# EasyEDA Pro project ProPrj_OAE board.epro

# Schematic OAE board 0.4
Board Name: OAE board 0.4; Create Date: 2025-04-07; Page Name: Sheet_1; Project Name: OAE board 0.2; Schematic Name: OAE board 0.4; Update Date: 2025-04-07; Add into BOM: yes; Company: Your Company; Convert to PCB: yes; Date: 2023-09-23; Draw By: intercipere; REV: 1.0; Sheet: 1/1
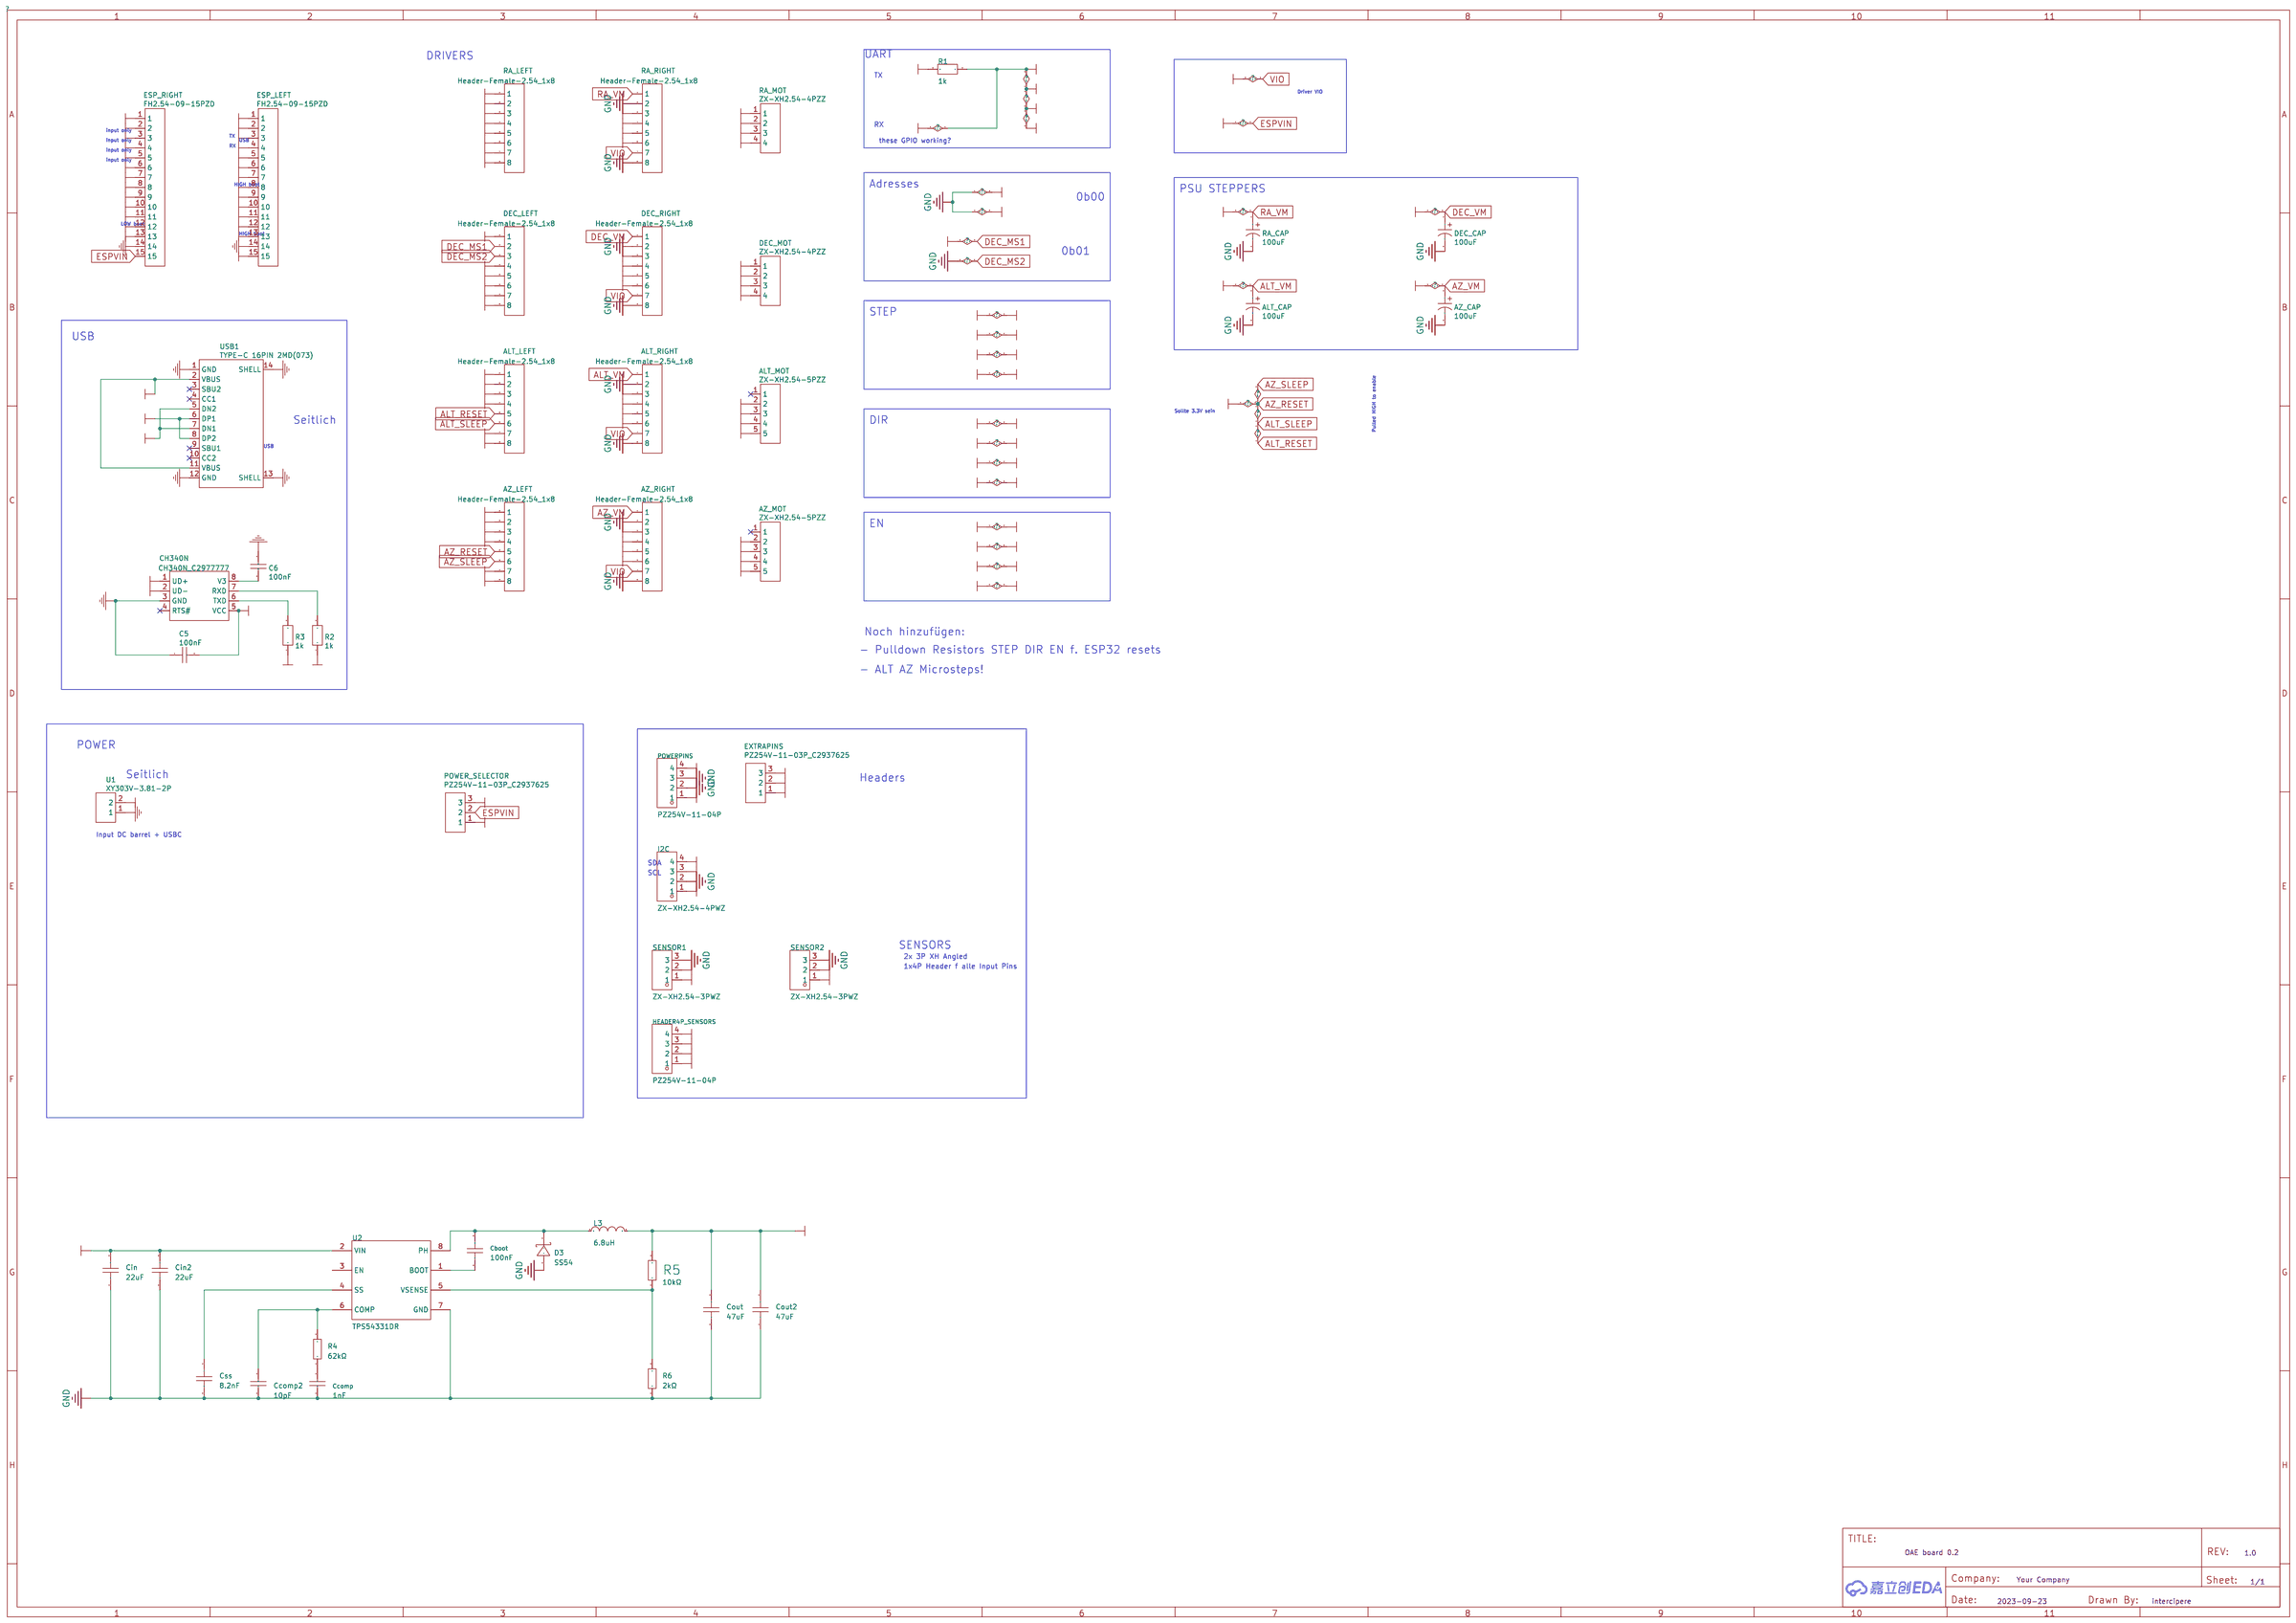
[diagram p0: schematic sheet]

## Parts
ALT_CAP  100uF  [CAP-SMD_BD6.3-L6.6-W6.6-LS7.4-FD]
ALT_LEFT  Header-Female-2.54_1x8  [HDR-TH_8P-P2.54-V-F-1]
ALT_MOT  ZX-XH2.54-5PZZ  [CONN-TH_5P-P2.50_ZX-XH2.54-5PZZ]
ALT_RIGHT  Header-Female-2.54_1x8  [HDR-TH_8P-P2.54-V-F-1]
AZ_CAP  100uF  [CAP-SMD_BD6.3-L6.6-W6.6-LS7.4-FD]
AZ_LEFT  Header-Female-2.54_1x8  [HDR-TH_8P-P2.54-V-F-1]
AZ_MOT  ZX-XH2.54-5PZZ  [CONN-TH_5P-P2.50_ZX-XH2.54-5PZZ]
AZ_RIGHT  Header-Female-2.54_1x8  [HDR-TH_8P-P2.54-V-F-1]
C5  100nF  [C0402]
C6  100nF  [C0402]
Cboot  100nF  [C0603]
Ccomp  1nF  [C0603]
Ccomp2  10pF  [C0603]
CH340N  CH340N_C2977777  [SOP-8_L4.9-W3.9-P1.27-LS6.0-BL]
Cin  22uF  [C0805]
Cin2  22uF  [C0805]
Cout  47uF  [C1206]
Cout2  47uF  [C1206]
Css  8.2nF  [C0603]
D3  SS54  [SMA_L4.4-W2.8-LS5.4-R-RD]
DEC_CAP  100uF  [CAP-SMD_BD6.3-L6.6-W6.6-LS7.4-FD]
DEC_LEFT  Header-Female-2.54_1x8  [HDR-TH_8P-P2.54-V-F-1]
DEC_MOT  ZX-XH2.54-4PZZ  [CONN-TH_4P-P2.50_4PIN]
DEC_RIGHT  Header-Female-2.54_1x8  [HDR-TH_8P-P2.54-V-F-1]
ESP_LEFT  FH2.54-09-15PZD  [HDR-TH_15P-P2.54-V-F-1]
ESP_RIGHT  FH2.54-09-15PZD  [HDR-TH_15P-P2.54-V-F-1]
EXTRAPINS  PZ254V-11-03P_C2937625  [HDR-TH_3P-P2.54-V-M]
HEADER4P_SENSORS  PZ254V-11-04P  [HDR-TH_4P-P2.54-V-M]
I2C  ZX-XH2.54-4PWZ  [CONN-TH_4P-P2.50_ZX-XH2.54-4PWZ]
L3  6.8uH  [IND-SMD_L2.0-W1.3]
POWER_SELECTOR  PZ254V-11-03P_C2937625  [HDR-TH_3P-P2.54-V-M]
POWERPINS  PZ254V-11-04P  [HDR-TH_4P-P2.54-V-M]
R1  1k  [R0603]
R2  1k  [R0603]
R3  1k  [R0603]
R4  62kΩ  [R0805]
R5  10kΩ  [R0603]
R6  2kΩ  [R0603]
RA_CAP  100uF  [CAP-SMD_BD6.3-L6.6-W6.6-LS7.4-FD]
RA_LEFT  Header-Female-2.54_1x8  [HDR-TH_8P-P2.54-V-F-1]
RA_MOT  ZX-XH2.54-4PZZ  [CONN-TH_4P-P2.50_4PIN]
RA_RIGHT  Header-Female-2.54_1x8  [HDR-TH_8P-P2.54-V-F-1]
SENSOR1  ZX-XH2.54-3PWZ  [HDR-TH_3P-P2.50_ZX-XH2.54-3PWZ]
SENSOR2  ZX-XH2.54-3PWZ  [HDR-TH_3P-P2.50_ZX-XH2.54-3PWZ]
U1  XY303V-3.81-2P  [CONN-TH_XY303V-3.81-2P]
U2  TPS54331DR  [SOIC-8_L5.0-W4.0-P1.27-LS6.0-BL]
USB1  TYPE-C 16PIN 2MD(073)  [USB-C-SMD_TYPE-C-6PIN-2MD-073]

## Library data of the parts
ALT_CAP AZ_CAP DEC_CAP RA_CAP = 100uF: Supplier: LCSC; Supplier Part: C2836437; Manufacturer: KNSCHA(科尼盛); Manufacturer Part: RVE100UF35V67RV0072; JLCPCB Part Class: Extended Part; link: https://lcsc.com/eda_search?q=C2836442&%26type=1&ref=editor
ALT_LEFT ALT_RIGHT AZ_LEFT AZ_RIGHT DEC_LEFT DEC_RIGHT RA_LEFT RA_RIGHT = Header-Female-2.54_1x8: Supplier: LCSC; Manufacturer: BOOMELE(博穆精密); Supplier Part: C27438; JLCPCB Part Class: Extended Part
ALT_MOT AZ_MOT = ZX-XH2.54-5PZZ: Supplier: LCSC; Supplier Part: C7429635; Manufacturer: Megastar(兆星); JLCPCB Part Class: Extended Part; link: https://lcsc.com/eda_search?q=C7429635&%26type=1&ref=editor
C5 C6 = 100nF: Supplier: LCSC; Manufacturer Part: CL05B104KO5NNNC; Manufacturer: SAMSUNG(三星); Supplier Part: C1525; JLCPCB Part Class: Basic Part; link: https://lcsc.com/eda_search?q=C1525&%26type=1&ref=editor
Cboot = CC0603KRX7R9BB104: Capacitance: Tolerance:±10% Tolerance:±10% Voltage Rated: Temperature Coefficient:; LCSC Part Name: 100nF ±10% 50V; Supplier Part: C14663; Manufacturer: YAGEO(国巨); Supplier Footprint: 0603; JLCPCB Part Class: Basic Part; Datasheet: https://atta.szlcsc.com/upload/public/pdf/source/20180910/C282072_33301C7F631E79921B82A8DAC6BCC5B3.pdf; Supplier: LCSC; Tolerance: ±10%
Ccomp = CL10B102KB8NNNC: Capacitance: Tolerance:±10% Tolerance:±10% Voltage Rated: Temperature Coefficient:; LCSC Part Name: 1nF ±10% 50V; Supplier Part: C1588; Manufacturer: SAMSUNG(三星); Supplier Footprint: 0603; JLCPCB Part Class: Basic Part; Datasheet: https://atta.szlcsc.com/upload/public/pdf/source/20160218/1457707763339.pdf; Supplier: LCSC; Tolerance: ±10%
Ccomp2 = CL10C100JB8NNNC: Capacitance: Tolerance:±5% Tolerance:±5% Voltage Rated: Temperature Coefficient:; LCSC Part Name: 10pF ±5% 50V; Supplier Part: C1634; Manufacturer: SAMSUNG(三星); Supplier Footprint: 0603; JLCPCB Part Class: Basic Part; Datasheet: https://atta.szlcsc.com/upload/public/pdf/source/20160218/1457707763339.pdf; Supplier: LCSC; Tolerance: ±5%
CH340N = CH340N_C2977777: Supplier: LCSC; Supplier Part: C2977777; Manufacturer: WCH(南京沁恒); JLCPCB Part Class: Extended Part; link: https://lcsc.com/eda_search?q=C2977777&%26type=1&ref=editor
Cin Cin2 = CL21A226MAQNNNE: Capacitance: Tolerance:±20% Tolerance:±20% Voltage Rated: Temperature Coefficient:; LCSC Part Name: 22uF ±20% 25V; Supplier Part: C45783; Manufacturer: SAMSUNG(三星); Supplier Footprint: 0805; JLCPCB Part Class: Basic Part; Datasheet: https://atta.szlcsc.com/upload/public/pdf/source/20160218/1457707763339.pdf; Supplier: LCSC; Tolerance: ±20%
Cout Cout2 = CL31A476MPHNNNE: Capacitance: Tolerance:±20% Tolerance:±20% Voltage Rated: Temperature Coefficient:; LCSC Part Name: 47uF ±20% 10V; Supplier Part: C96123; Manufacturer: SAMSUNG(三星); Supplier Footprint: 1206; JLCPCB Part Class: Basic Part; Datasheet: https://atta.szlcsc.com/upload/public/pdf/source/20160218/1457707763339.pdf; Supplier: LCSC; Tolerance: ±20%
Css = 0603B822K500NT: Capacitance:8.2nF Tolerance:±10% Tolerance:±10% Voltage Rated: Temperature Coefficient:; LCSC Part Name: 8.2nF ±10% 50V; Supplier Part: C1322360; Manufacturer: FH(风华); Supplier Footprint: 0603; JLCPCB Part Class: Basic Part; Datasheet: https://atta.szlcsc.com/upload/public/pdf/source/20200305/C486355_26A10D38EF8C2A5C37091D0039909270.pdf; Supplier: LCSC; Tolerance: ±10%
D3 = SS54_C22452: Diode Configuration:Independent Type Forward Voltage (Vf@If):550mV@5A Reverse Voltage (Vr):40V Rectified Current:5A Reverse Leakage Current (Ir):1mA@40V; LCSC Part Name: 电压:40V 电流:5A; Supplier Part: C22452; Manufacturer: MDD(辰达半导体); Supplier Footprint: SMA(DO-214AC); JLCPCB Part Class: Basic Part; Datasheet: https://atta.szlcsc.com/upload/public/pdf/source/20240710/73DFBB65C1883B895E62D589679033DF.pdf; Supplier: LCSC; Diode Configuration: Independent Type; Forward Voltage (Vf@If): 550mV@5A; Reverse Voltage (Vr): 40V; Rectified Current: 5A; Reverse Leakage Current (Ir): 1mA@40V
DEC_MOT RA_MOT = ZX-XH2.54-4PZZ: Supplier: LCSC; Supplier Part: C7429634; Manufacturer: Megastar(兆星); JLCPCB Part Class: Extended Part; link: https://lcsc.com/eda_search?q=C7429634&%26type=1&ref=editor
ESP_LEFT ESP_RIGHT = FH2.54-09-15PZD: Supplier: LCSC; Supplier Part: C7499333; Manufacturer: XUNPU(讯普); Manufacturer Part: ZX-PM2.54-1-15PY; JLCPCB Part Class: Extended Part
EXTRAPINS POWER_SELECTOR = PZ254V-11-03P_C2937625: Supplier: LCSC; Supplier Part: C2937625; Manufacturer: XFCN(兴飞); Manufacturer Part: PZ254V-11-03P; JLCPCB Part Class: Extended Part; link: https://lcsc.com/eda_search?q=C2937625&%26type=1&ref=editor
HEADER4P_SENSORS POWERPINS = PZ254V-11-04P: Pin Structure:1x4P Pitch:2.54mm Row Spacing:- Circluar Pins/Square Pins:Square Pins Mounting Type:Straight Number of Rows:Plugin Number of Pins:4P Current Rating (Max):3A Voltage Rating (Max):250V Length of Mating Pin:6mm Insulation Height:2.5mm Length of; LCSC Part Name: 间距:2.54mm 1x4P 直插 方针; Supplier Part: C2691448; Manufacturer: XFCN(兴飞); Supplier Footprint: 插件,P=2.54mm; JLCPCB Part Class: Extended Part; Datasheet: https://atta.szlcsc.com/upload/public/pdf/source/20200309/C492403_F9F19131791D08044AD4F84F8E751A34.pdf; Supplier: LCSC; Pin Structure: 1x4P; Pitch: 2.54mm; Circluar Pins/Square Pins: Square Pins; Mounting Type: Straight; Number of Rows: Plugin; Number of Pins: 4P; Current Rating (Max): 3A; Voltage Rating (Max): 250V; Length of Mating Pin: 6mm; Insulation Height: 2.5mm; Length of End Connection Pin: 3mm; Operating Temperature Range: -40℃~+105℃; Color: Black
I2C = ZX-XH2.54-4PWZ: Pins Structure:1x4P Pitch:2.5mm Mounting Type:Bend-in Reference Series:XH Number of Pins:4P Number of Rows:1 Number of PINs Per Row:4 Row Spacing:- Rated Current:3A Contact Material:Brass Contact Plating:Tin Operating Temperature:-25℃~+85℃ Operating Tempe; LCSC Part Name: 1x4P 间距:2.5mm 弯插 系列:XH; Supplier Part: C7429643; Manufacturer: Megastar(兆星); Supplier Footprint: 弯插,P=2.5mm; JLCPCB Part Class: Extended Part; Datasheet: https://atta.szlcsc.com/upload/public/pdf/source/20230619/8DC602C7BA46C153FF1BE89D90453879.pdf; Supplier: LCSC; Pins Structure: 1x4P; Pitch: 2.5mm; Mounting Type: Bend-in; Reference Series: XH; Number of Pins: 4P; Number of Rows: 1; Number of PINs Per Row: 4; Rated Current: 3A; Contact Material: Brass; Contact Plating: Tin; Operating Temperature: -25℃~+85℃; Rated Voltage (Max): 250V; Plastic Material: PA66; Flame Retardant Rating: UL94V-0; Color: White; Z-Height of the Board: 5.9mm; X-Length of Bottom Edge on Board (Spacing Line): 12.5mm; Y-Width of Bottom Edge on Board: 7.32mm
L3 = MLZ2012N6R8LT000: Inductance: Tolerance:±20% Tolerance:±20% Rated Current:- Saturation Current (Isat):110mA DC Resistance (DCR): Q @ Freq:- Frequency - Self Resonant: Ratings:; LCSC Part Name: 6.8uH ±20% 110mA; Supplier Part: C82157; Manufacturer: TDK; Supplier Footprint: 0805; JLCPCB Part Class: Extended Part; Datasheet: https://atta.szlcsc.com/upload/public/pdf/source/20170728/C88184_1501225891301849075.pdf; Supplier: LCSC; Tolerance: ±20%; Saturation Current (Isat): 110mA
R1-R3 = 1k
R4 = 0805W8F6202T5E: Type:Thick Film Resistors Resistance:62kΩ Tolerance:±1% Tolerance:±1% Power(Watts): Overload Voltage (Max): Temperature Coefficient:±100ppm/℃ Temperature Coefficient:±100ppm/℃ Operating Temperature Range:-55℃~+155℃ Operating Temperature Range:-55℃~+155℃; LCSC Part Name: 62kΩ ±1% 125mW 厚膜电阻; Supplier Part: C17783; Manufacturer: UNI-ROYAL(厚声); Supplier Footprint: 0805; JLCPCB Part Class: Extended Part; Datasheet: https://atta.szlcsc.com/upload/public/pdf/source/20200306/C422600_1E6D84923E4A46A82E41ADD87F860B5C.pdf; Supplier: LCSC; Type: Thick Film Resistors; Tolerance: ±1%; Temperature Coefficient: ±100ppm/℃; Operating Temperature Range: -55℃~+155℃
R5 = 0603WAF1002T5E: Type:Thick Film Resistors Resistance:10kΩ Tolerance:±1% Tolerance:±1% Power(Watts): Overload Voltage (Max): Temperature Coefficient:±100ppm/℃ Temperature Coefficient:±100ppm/℃ Operating Temperature Range:-55℃~+155℃ Operating Temperature Range:-55℃~+155℃; LCSC Part Name: 厚膜电阻 10kΩ ±1% 100mW; Supplier Part: C25804; Manufacturer: UNI-ROYAL(厚声); Supplier Footprint: 0603; JLCPCB Part Class: Basic Part; Datasheet: https://atta.szlcsc.com/upload/public/pdf/source/20200306/C422600_1E6D84923E4A46A82E41ADD87F860B5C.pdf; Supplier: LCSC; Type: Thick Film Resistors; Tolerance: ±1%; Temperature Coefficient: ±100ppm/℃; Operating Temperature Range: -55℃~+155℃
R6 = 0603WAF2001T5E: Type:Thick Film Resistors Resistance:2kΩ Tolerance:±1% Tolerance:±1% Power(Watts): Overload Voltage (Max): Temperature Coefficient:±100ppm/℃ Temperature Coefficient:±100ppm/℃ Operating Temperature Range:-55℃~+155℃ Operating Temperature Range:-55℃~+155℃; LCSC Part Name: 2kΩ ±1% 100mW 厚膜电阻; Supplier Part: C22975; Manufacturer: UNI-ROYAL(厚声); Supplier Footprint: 0603; JLCPCB Part Class: Basic Part; Datasheet: https://atta.szlcsc.com/upload/public/pdf/source/20200306/C422600_1E6D84923E4A46A82E41ADD87F860B5C.pdf; Supplier: LCSC; Type: Thick Film Resistors; Tolerance: ±1%; Temperature Coefficient: ±100ppm/℃; Operating Temperature Range: -55℃~+155℃
SENSOR1 SENSOR2 = ZX-XH2.54-3PWZ: Pins Structure:1x3P Pitch:2.5mm Mounting Type:Bend-in Reference Series:XH Number of Pins:3P Number of Rows:1 Number of PINs Per Row:3 Row Spacing:- Rated Current:3A Contact Material:Brass Contact Plating:Tin Operating Temperature:-25℃~+85℃ Operating Tempe; LCSC Part Name: 1x3P 间距:2.5mm 弯插 系列:XH; Supplier Part: C7429642; Manufacturer: Megastar(兆星); Supplier Footprint: 弯插,P=2.5mm; JLCPCB Part Class: Extended Part; Datasheet: https://atta.szlcsc.com/upload/public/pdf/source/20230619/C14C6D497540E786127C4950A1FC83E6.pdf; Supplier: LCSC; Pins Structure: 1x3P; Pitch: 2.5mm; Mounting Type: Bend-in; Reference Series: XH; Number of Pins: 3P; Number of Rows: 1; Number of PINs Per Row: 3; Rated Current: 3A; Contact Material: Brass; Contact Plating: Tin; Operating Temperature: -25℃~+85℃; Rated Voltage (Max): 250V; Plastic Material: PA66; Flame Retardant Rating: UL94V-0; Color: White; Z-Height of the Board: 5.9mm; X-Length of Bottom Edge on Board (Spacing Line): 10mm; Y-Width of Bottom Edge on Board: 7.32mm
U1 = XY303V-3.81-2P: Supplier: LCSC; Supplier Part: C557683; Manufacturer: XINLAIYA(新莱亚); JLCPCB Part Class: Extended Part; link: https://lcsc.com/eda_search?q=C557683&%26type=1&ref=editor
U2 = TPS54331DR: Function:Step-down type Output Type:Adjustable Input Voltage:3.5V~28V Input Voltage:3.5V~28V Output Voltage:- Output Voltage:- Output Current:3A Switching Frequency:570kHz Switching Frequency:570kHz Operating Temperature:-40℃~+150℃@(TJ) Operating Temperat; LCSC Part Name: 3A, 28V 输入非同步降压转换器; Supplier Part: C9865; Manufacturer: TI(德州仪器); Supplier Footprint: SOIC-8; JLCPCB Part Class: Extended Part; Datasheet: https://www.ti.com/cn/lit/gpn/tps54331; Supplier: LCSC; Function: Step-down type; Output Type: Adjustable; Input Voltage: 3.5V~28V; Output Current: 3A; Switching Frequency: 570kHz; Operating Temperature: -40℃~+150℃@(TJ); Synchronous Rectification: No; Number of Outputs: 1; Topology: Step-down; Quiescent Current (Iq): 1mA; Switch tube (built-in/external): Built-in
USB1 = TYPE-C 16PIN 2MD(073): Supplier: LCSC; Supplier Part: C2765186; Manufacturer: SHOU HAN(首韩); JLCPCB Part Class: Extended Part; link: https://lcsc.com/eda_search?q=C2765186&%26type=1&ref=editor

## Nets
5V2A: Cout.2 Cout2.2 ESP_RIGHT.15 I2C.1 L3.2 POWER_SELECTOR.1 POWER_SELECTOR.2 POWERPINS.1 R5.2 SENSOR1.1 SENSOR2.1
GND: ALT_CAP.2 ALT_RIGHT.2 ALT_RIGHT.8 AZ_CAP.2 AZ_RIGHT.2 AZ_RIGHT.8 C5.1 C6.2 Ccomp.1 Ccomp2.1 CH340N.3(GND) Cin.1 Cin2.1 Cout.1 Cout2.1 Css.2 D3.1(A) DEC_CAP.2 DEC_LEFT.3 DEC_RIGHT.2 DEC_RIGHT.8 ESP_LEFT.14 ESP_RIGHT.14 I2C.2 POWERPINS.2 POWERPINS.3 R6.1 RA_CAP.2 RA_LEFT.2 RA_LEFT.3 RA_RIGHT.2 RA_RIGHT.8 SENSOR1.3 SENSOR2.3 U1.1 U2.7(GND) USB1.1(GND) USB1.12(GND) USB1.13(SHELL) USB1.14(SHELL)
ALT_A1: ALT_MOT.4 ALT_RIGHT.4
ALT_A2: ALT_MOT.2 ALT_RIGHT.3
ALT_B1: ALT_MOT.3 ALT_RIGHT.5
ALT_B2: ALT_MOT.5 ALT_RIGHT.6
ALT_DIR: ALT_LEFT.8 ESP_LEFT.1
ALT_EN: ALT_LEFT.1 ESP_LEFT.11
ALT_MS1: ALT_LEFT.2
ALT_MS2: ALT_LEFT.3
ALT_MS3: ALT_LEFT.4
ALT_STEP: ALT_LEFT.7 ESP_RIGHT.13
AZ_A1: AZ_MOT.4 AZ_RIGHT.4
AZ_A2: AZ_MOT.2 AZ_RIGHT.3
AZ_B1: AZ_MOT.3 AZ_RIGHT.5
AZ_B2: AZ_MOT.5 AZ_RIGHT.6
AZ_DIR: AZ_LEFT.8 ESP_LEFT.6
AZ_EN: AZ_LEFT.1 ESP_RIGHT.6
AZ_MS1: AZ_LEFT.2
AZ_MS2: AZ_LEFT.3
AZ_MS3: AZ_LEFT.4
AZ_STEP: AZ_LEFT.7 ESP_LEFT.7
DEC_A1: DEC_MOT.2 DEC_RIGHT.4
DEC_A2: DEC_MOT.1 DEC_RIGHT.3
DEC_B1: DEC_MOT.3 DEC_RIGHT.5
DEC_B2: DEC_MOT.4 DEC_RIGHT.6
DEC_CLK: DEC_LEFT.6
DEC_DIR: DEC_LEFT.8 ESP_LEFT.8
DEC_EN: DEC_LEFT.1 ESP_RIGHT.7
DEC_STEP: DEC_LEFT.7 ESP_RIGHT.8
DEC_UART1: DEC_LEFT.4 DEC_LEFT.5 ESP_LEFT.10 R1.1 RA_LEFT.4 RA_LEFT.5
ESP_EN: ESP_RIGHT.1
ESPRX: ESP_LEFT.4 R3.1
ESPTX: ESP_LEFT.3 R2.1
ESPVOUT: ALT_LEFT.5 ALT_LEFT.6 ALT_RIGHT.7 AZ_LEFT.5 AZ_LEFT.6 AZ_RIGHT.7 DEC_LEFT.2 DEC_RIGHT.7 ESP_LEFT.15 RA_RIGHT.7
GPIO2: ESP_LEFT.12 EXTRAPINS.1
GPIO12: ESP_RIGHT.12 EXTRAPINS.2
GPIO14: ESP_RIGHT.11 RA_LEFT.7
GPIO15: ESP_LEFT.13 EXTRAPINS.3
GPIO17: ESP_LEFT.9 R1.2
GPIO21: ESP_LEFT.5 I2C.4
GPIO22: ESP_LEFT.2 I2C.3
GPIO26: ESP_RIGHT.9 RA_LEFT.8
GPIO27: ESP_RIGHT.10 RA_LEFT.1
GPIO34: ESP_RIGHT.4 HEADER4P_SENSORS.4
GPIO35: ESP_RIGHT.5 HEADER4P_SENSORS.3
GPIO36: ESP_RIGHT.2 HEADER4P_SENSORS.2 SENSOR2.2
GPIO39: ESP_RIGHT.3 HEADER4P_SENSORS.1 SENSOR1.2
PSU12V: ALT_CAP.1 ALT_RIGHT.1 AZ_CAP.1 AZ_RIGHT.1 Cin.2 Cin2.2 DEC_CAP.1 DEC_RIGHT.1 POWERPINS.4 RA_CAP.1 RA_RIGHT.1 U1.2 U2.2(VIN)
RA_A1: RA_MOT.2 RA_RIGHT.4
RA_A2: RA_MOT.1 RA_RIGHT.3
RA_B1: RA_MOT.3 RA_RIGHT.5
RA_B2: RA_MOT.4 RA_RIGHT.6
RA_CLK: RA_LEFT.6
USB5V: C5.2 CH340N.5(VCC) POWER_SELECTOR.3 USB1.2(VBUS) USB1.11(VBUS)
USBDN: CH340N.2(UD-) USB1.5(DN2) USB1.7(DN1)
USBDP: CH340N.1(UD+) USB1.6(DP1) USB1.8(DP2)
$1N15: C6.1 CH340N.8(V3)
$1N26: CH340N.7(RXD) R2.2
$1N27: CH340N.6(TXD) R3.2
$1N12989: Ccomp2.2 R4.2 U2.6(COMP)
$1N13151: Ccomp.2 R4.1
$1N13245: Cboot.1 U2.1(BOOT)
$1N13249: Cboot.2 D3.2(K) L3.1 U2.8(PH)
$1N13607: R5.1 R6.2 U2.5(VSENSE)
$1N13891: Css.1 U2.4(SS)

Not connected (* = marked no-connect by the designer): ALT_MOT 1*; AZ_MOT 1*; CH340N 4(RTS#)*; U2 3(EN); USB1 3(SBU2)* 4(CC1)* 9(SBU1)* 10(CC2)*

## Notes on the sheet
- DRIVERS
- UART
- TX
- Driver VIO
- RX
- input only
- input only
- TX
- USB
- input only
- RX
- these GPIO working?
- input only
- HIGH boot
- Adresses
- PSU STEPPERS
- 0b00
- LOW boot
- HIGH boot
- 0b01
- STEP
- USB
- Sollte 3.3V sein
- Seitlich
- DIR
- Pulled HIGH to enable
- USB
- EN
- Noch hinzufügen:
- - Pulldown Resistors STEP DIR EN f. ESP32 resets
- - ALT AZ Microsteps!
- POWER
- Seitlich
- Headers
- Input DC barrel + USBC
- SDA
- SCL
- SENSORS
- 2x 3P XH Angled
- 1x4P Header f alle Input Pins

# Board PCB_OAE board 1.0
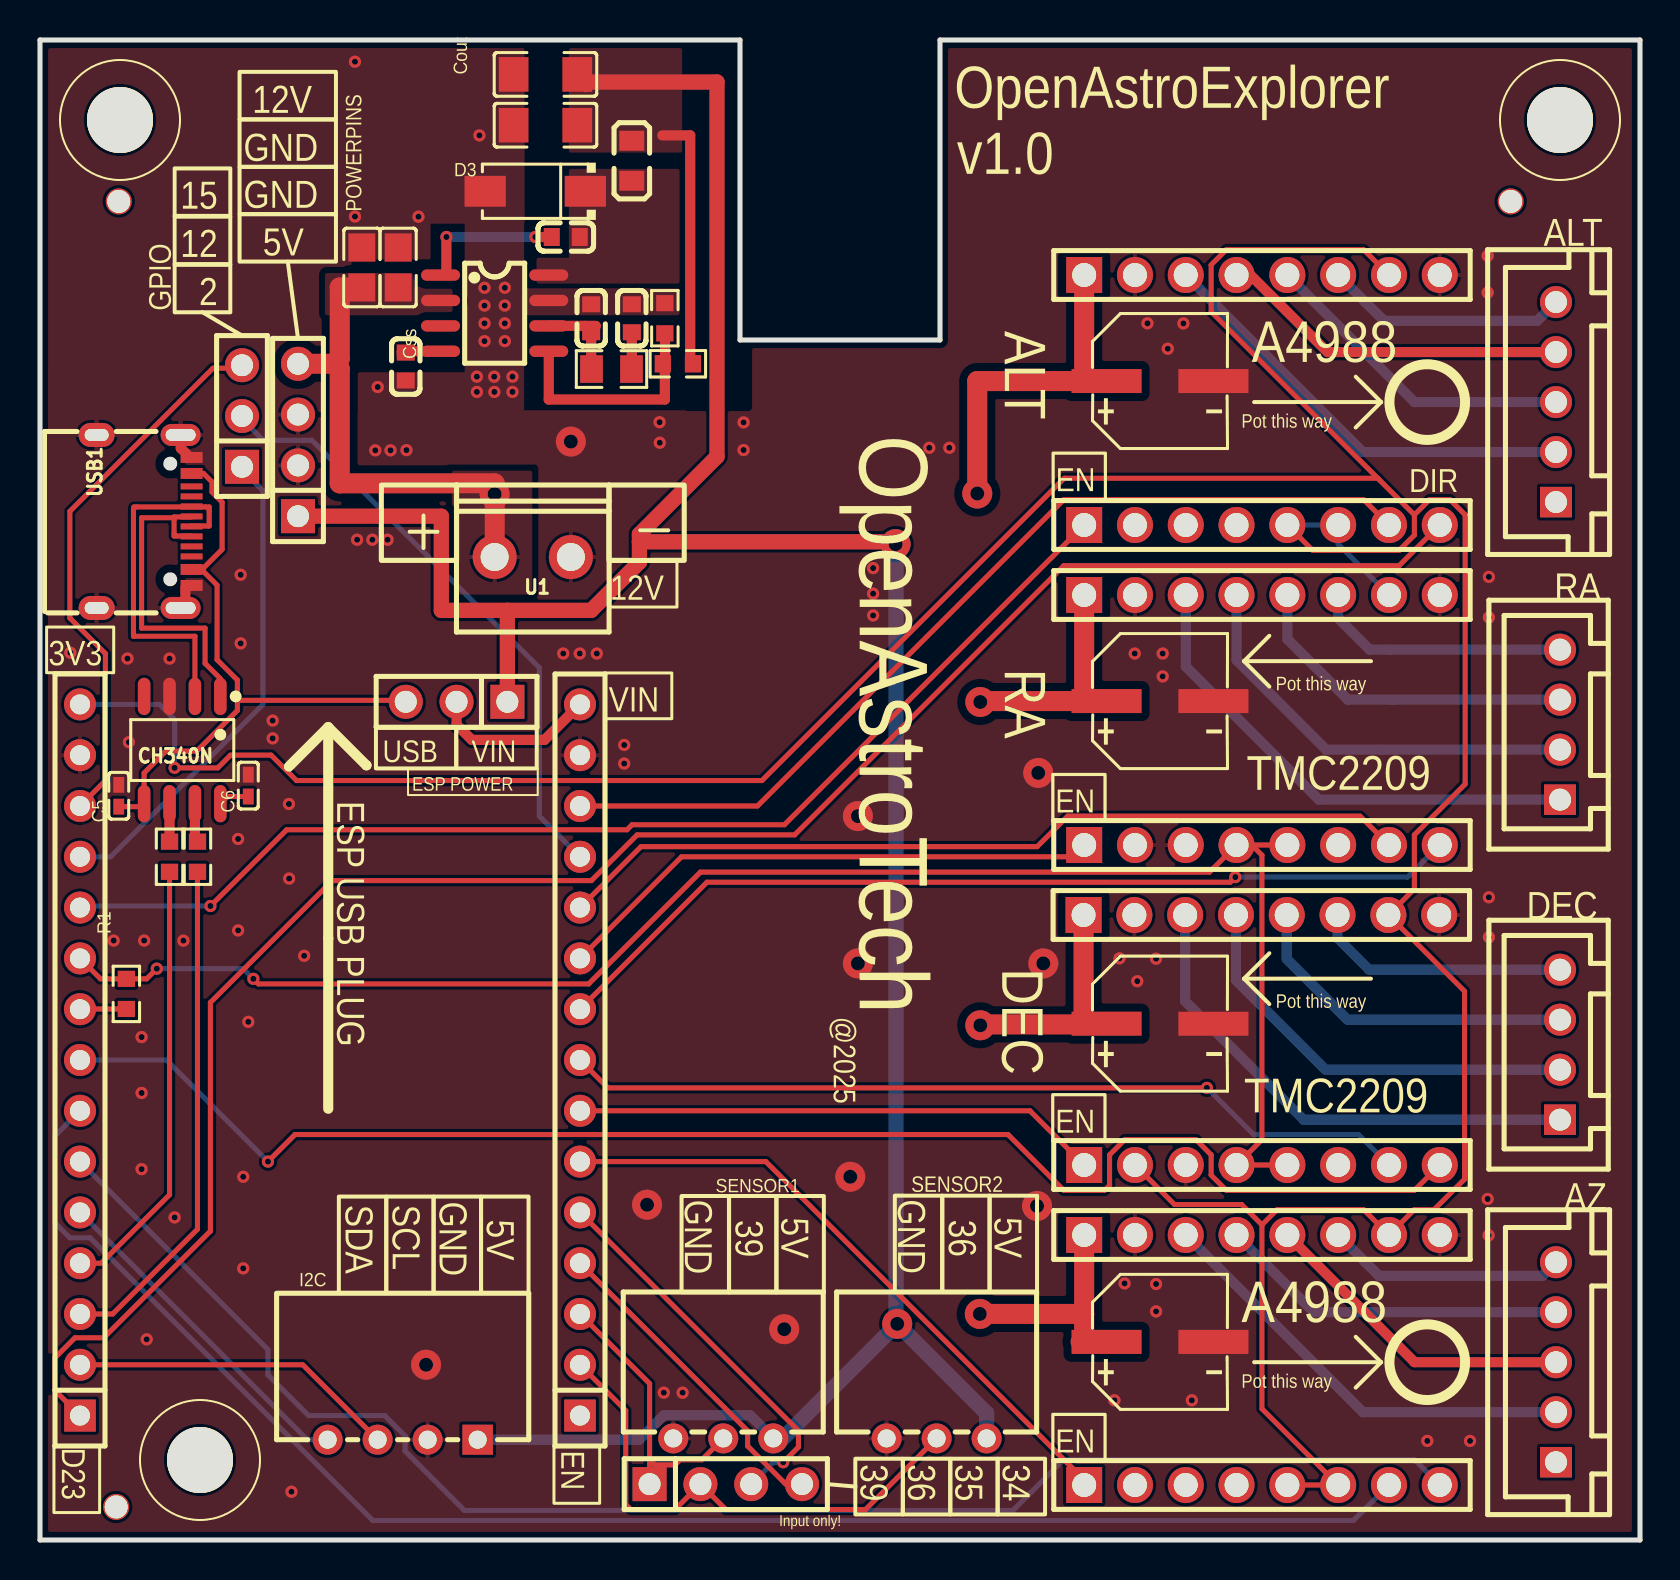
[diagram p1: board, top side]
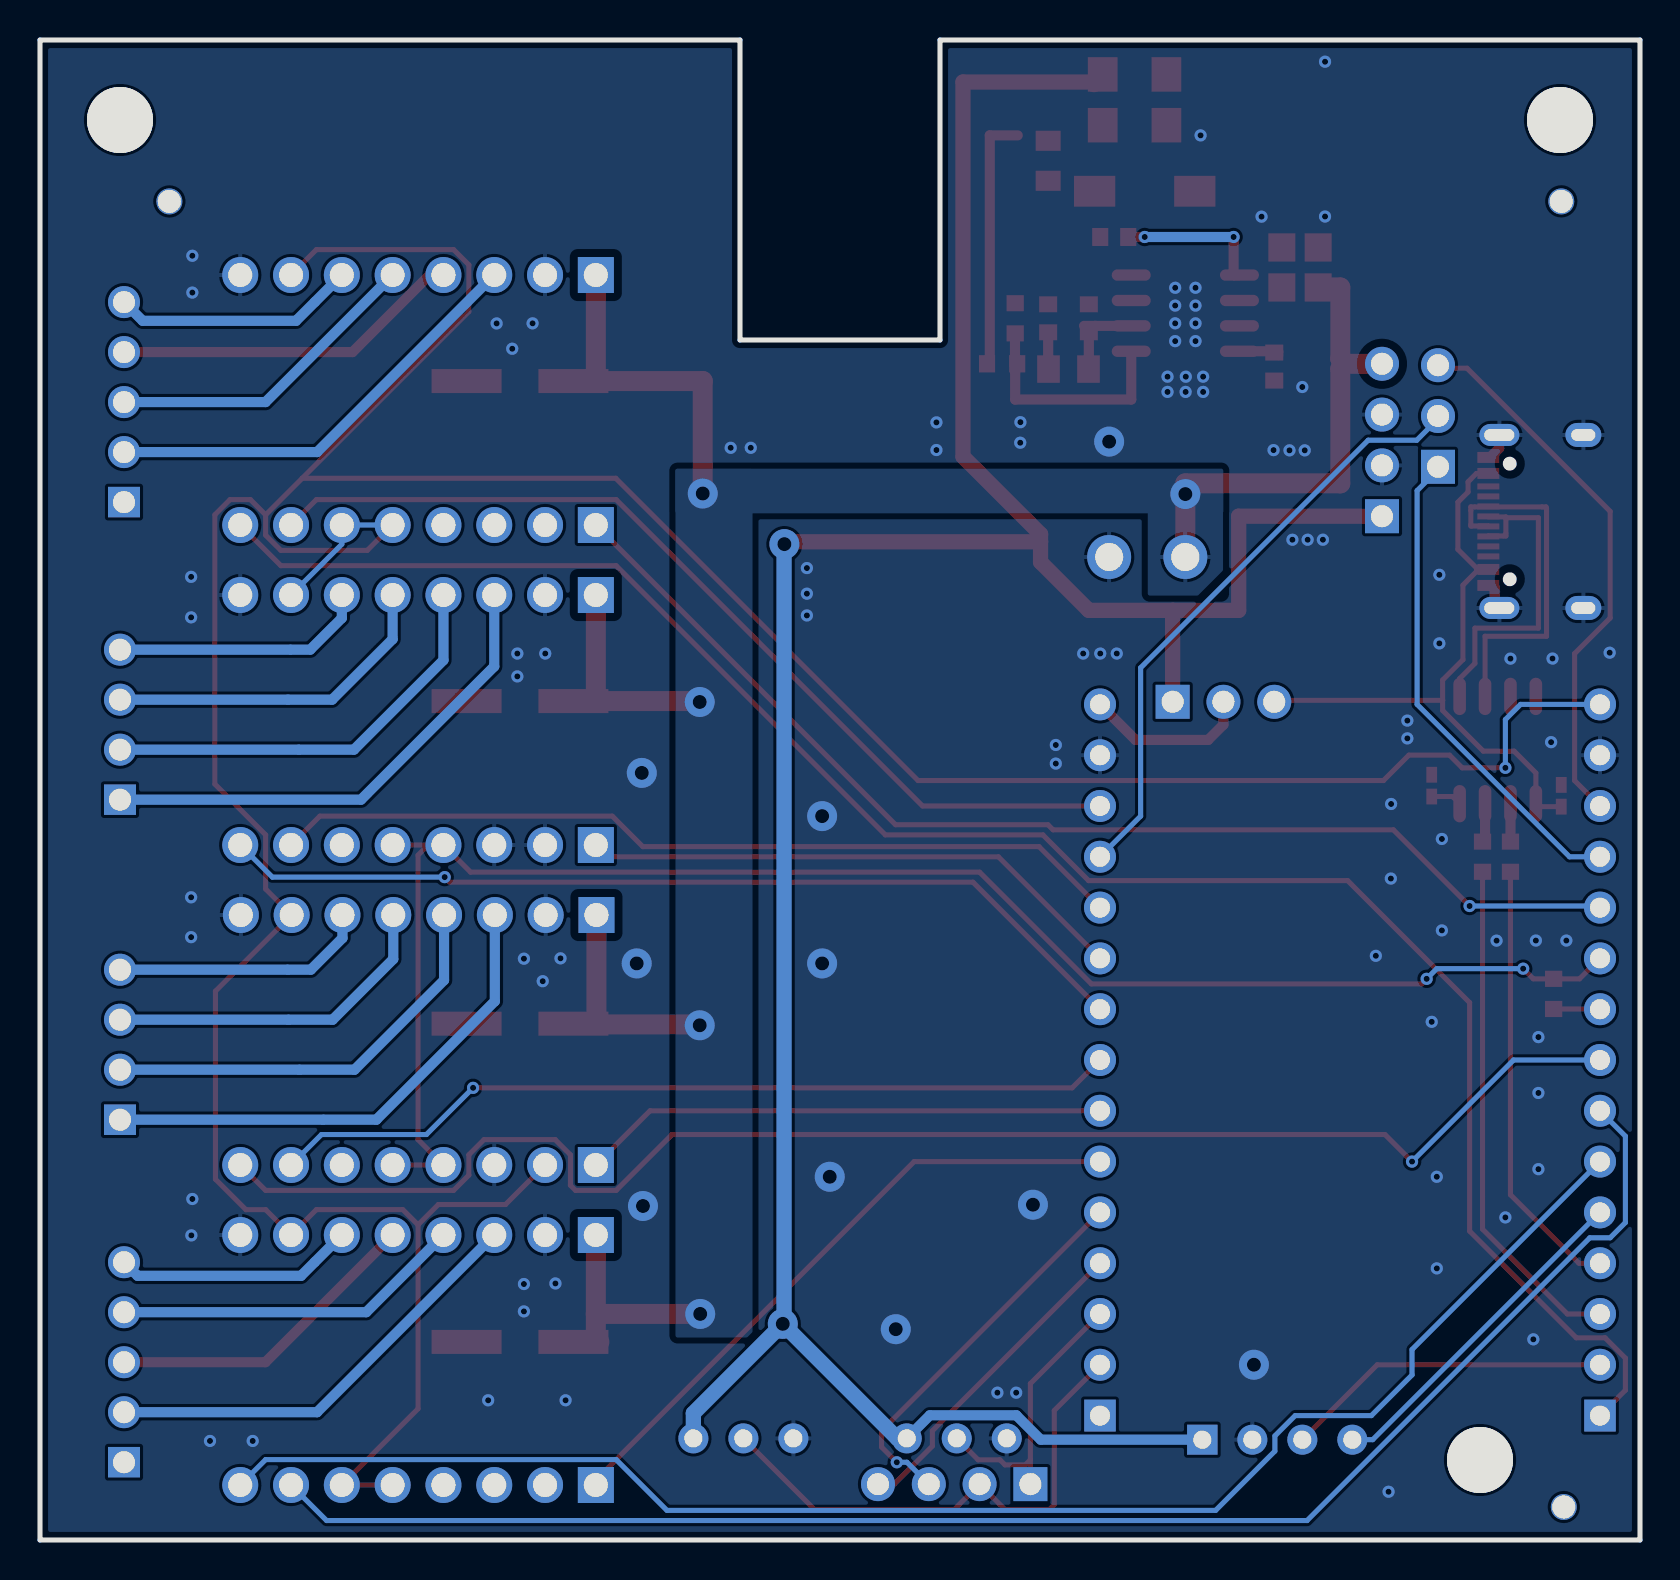
[diagram p2: board, bottom side, seen from below]

Outline 80 x 75 mm; copper layers: Top Layer, Bottom Layer. Coordinates in mm from the lower left corner of the outline.
Outline path: 0,75 0,0 80,0 80,75 45,75 45,60 35,60 35,75 0,75
Stack: Top Layer 0.035mm / Dielectric1 1.51mm FR4 er 4.5 / Bottom Layer 0.035mm

## Design rules (mm)
net RA_B1: RA_MOT
net RA_A2: RA_MOT
net RA_A1: RA_MOT
net RA_B2: RA_MOT
template: User Custom Config
spacing safeClearance (default): track to track 0.152, other pairs 0.152 to 0.3
track width trackWidth (default): min 0.127, default 0.254, max 2.54
differential pair differentialPair (default): width min 0.127, default 0.254, max 2.54; gap min 0.152, default 0.152
via viaSize (default): diameter min 0.5, default 0.61, max 10; hole min 0.3, default 0.305, max 5.999
net 5V2A uses copperRegion1
net GND uses copperRegion1
net PSU12V uses copperRegion2
net $1N13249 uses copperRegion1

## Placement (name value [footprint] x y rotation side)
ALT_CAP  100uF  [CAP-SMD_BD6.3-L6.6-W6.6-LS7.4-FD]  56 57.95 0 top
ALT_LEFT  Header-Female-2.54_1x8  [HDR-TH_8P-P2.54-V-F-1]  61.1 50.75 0 top
ALT_MOT  ZX-XH2.54-5PZZ  [CONN-TH_5P-P2.50_ZX-XH2.54-5PZZ]  75.8 56.9 90 top
ALT_RIGHT  Header-Female-2.54_1x8  [HDR-TH_8P-P2.54-V-F-1]  61.1 63.25 0 top
AZ_CAP  100uF  [CAP-SMD_BD6.3-L6.6-W6.6-LS7.4-FD]  56 9.91 0 top
AZ_LEFT  Header-Female-2.54_1x8  [HDR-TH_8P-P2.54-V-F-1]  61.1 2.75 0 top
AZ_MOT  ZX-XH2.54-5PZZ  [CONN-TH_5P-P2.50_ZX-XH2.54-5PZZ]  75.8 8.89 90 top
AZ_RIGHT  Header-Female-2.54_1x8  [HDR-TH_8P-P2.54-V-F-1]  61.1 15.25 0 top
C5  100nF  [C0402]  3.94 37.21 270 top
C6  100nF  [C0402]  10.41 37.72 90 top
Cboot  100nF  [C0603]  26.29 65.15 0 top
Ccomp  1nF  [C0603]  29.59 61.09 270 top
Ccomp2  10pF  [C0603]  27.56 61.09 270 top
CH340N  CH340N_C2977777  [SOP-8_L4.9-W3.9-P1.27-LS6.0-BL]  7.11 39.5 180 top
Cin  22uF  [C0805]  17.91 63.63 270 top
Cin2  22uF  [C0805]  16.09 63.63 270 top
Cout  47uF  [C1206]  25.27 70.74 0 top
Cout2  47uF  [C1206]  25.27 73.28 0 top
Css  8.2nF  [C0603]  18.29 58.67 270 top
D3  SS54  [SMA_L4.4-W2.8-LS5.4-R-RD]  24.76 67.44 180 top
DEC_CAP  100uF  [CAP-SMD_BD6.3-L6.6-W6.6-LS7.4-FD]  56 25.82 0 top
DEC_LEFT  Header-Female-2.54_1x8  [HDR-TH_8P-P2.54-V-F-1]  61.1 18.75 0 top
DEC_MOT  ZX-XH2.54-4PZZ  [CONN-TH_4P-P2.50_4PIN]  76 24.77 90 top
DEC_RIGHT  Header-Female-2.54_1x8  [HDR-TH_8P-P2.54-V-F-1]  61.07 31.25 0 top
ESP_LEFT  FH2.54-09-15PZD  [HDR-TH_15P-P2.54-V-F-1]  2 24 90 top
ESP_RIGHT  FH2.54-09-15PZD  [HDR-TH_15P-P2.54-V-F-1]  27 24 90 top
EXTRAPINS  PZ254V-11-03P_C2937625  [HDR-TH_3P-P2.54-V-M]  10.1 56.2 90 top
HEADER4P_SENSORS  PZ254V-11-04P  [HDR-TH_4P-P2.54-V-M]  34.29 2.79 0 top
I2C  ZX-XH2.54-4PWZ  [CONN-TH_4P-P2.50_ZX-XH2.54-4PWZ]  18.13 5.02 180 top
L3  6.8uH  [IND-SMD_L2.0-W1.3]  29.59 68.96 90 top
NOREF  -  [Pad_e23642]  3.94 66.93 0 top
NOREF#2  -  [Pad_e100800]  8 4 0 top
NOREF#3  -  [Pad_e23773]  73.53 66.93 0 top
NOREF#4  -  [Pad_e100495]  76 71 0 top
NOREF#5  -  [Pad_e100399]  4 71 0 top
NOREF#6  -  [Pad_e23772]  3.81 1.65 0 top
POWER_SELECTOR  PZ254V-11-03P_C2937625  [HDR-TH_3P-P2.54-V-M]  20.83 41.91 180 top
POWERPINS  PZ254V-11-04P  [HDR-TH_4P-P2.54-V-M]  12.9 55 90 top
R1  1k  [R0603]  4.32 27.31 270 top
R2  1k  [R0603]  7.87 34.16 90 top
R3  1k  [R0603]  6.48 34.16 90 top
R4  62kΩ  [R0805]  28.57 58.55 180 top
R5  10kΩ  [R0603]  31.89 58.81 0 top
R6  2kΩ  [R0603]  31.24 61.09 270 top
RA_CAP  100uF  [CAP-SMD_BD6.3-L6.6-W6.6-LS7.4-FD]  56 41.95 0 top
RA_LEFT  Header-Female-2.54_1x8  [HDR-TH_8P-P2.54-V-F-1]  61.1 34.75 0 top
RA_MOT  ZX-XH2.54-4PZZ  [CONN-TH_4P-P2.50_4PIN]  76 40.77 90 top
RA_RIGHT  Header-Female-2.54_1x8  [HDR-TH_8P-P2.54-V-F-1]  61.1 47.25 0 top
SENSOR1  ZX-XH2.54-3PWZ  [HDR-TH_3P-P2.50_ZX-XH2.54-3PWZ]  34.16 5.08 180 top
SENSOR2  ZX-XH2.54-3PWZ  [HDR-TH_3P-P2.50_ZX-XH2.54-3PWZ]  44.83 5.08 180 top
U1  XY303V-3.81-2P  [CONN-TH_XY303V-3.81-2P]  24.64 49.15 180 top
U2  TPS54331DR  [SOIC-8_L5.0-W4.0-P1.27-LS6.0-BL]  22.73 61.34 270 top
USB1  TYPE-C 16PIN 2MD(073)  [USB-C-SMD_TYPE-C-6PIN-2MD-073]  5.21 50.93 270 top

## Footprints (pads in the part's own frame, mm; a bottom-side part is the same pattern mirrored in y, then rotated)
C0402
  rect 0.79x0.54 smd: 1(-0.545,0) 2(0.545,0)
C0603
  rect 0.8x0.9 smd: 1(-0.7,0) 2(0.7,0)
C0805
  rect 1.41x1.35 smd: 1(-1,0) 2(1,0)
C1206
  rect 1.485x1.728 smd: 1(-1.593,0) 2(1.593,0)
CAP-SMD_BD6.3-L6.6-W6.6-LS7.4-FD
  rect 3.5x1.2 smd: 1(-2.67,0) 2(2.67,0)
CONN-TH_4P-P2.50_4PIN
  rect 1.524x1.6 hole 1.1: 1(-3.75,0)
  round 1.6 hole 1.1: 2(-1.25,0) 3(1.25,0) 4(3.75,0)
CONN-TH_4P-P2.50_ZX-XH2.54-4PWZ
  rect 1.524x1.5 hole 0.9: 1(-3.75,0)
  round 1.5 hole 0.9: 2(-1.25,0) 3(1.25,0) 4(3.75,0)
CONN-TH_5P-P2.50_ZX-XH2.54-5PZZ
  rect 1.524x1.6 hole 1.1: 1(-5,0)
  round 1.6 hole 1.1: 2(-2.5,0) 3(0,0) 4(2.5,0) 5(5,0)
CONN-TH_XY303V-3.81-2P
  round 2.2 hole 1.4: 1(-1.905,0) 2(1.905,0)
HDR-TH_3P-P2.50_ZX-XH2.54-3PWZ
  round 1.5 hole 0.9: 1(-2.5,0) 2(0,0) 3(2.5,0)
HDR-TH_3P-P2.54-V-M
  rect 1.7x1.7 hole 1.1: 1(-2.54,0)
  round 1.7 hole 1.1: 2(0,0) 3(2.54,0)
HDR-TH_4P-P2.54-V-M
  rect 1.7x1.7 hole 1.1: 1(-3.81,0)
  round 1.7 hole 1.1: 2(-1.27,0) 3(1.27,0) 4(3.81,0)
HDR-TH_8P-P2.54-V-F-1
  rect 1.8x1.8 hole 1.2: 1(-8.89,0)
  round 1.8 hole 1.2: 2(-6.35,0) 3(-3.81,0) 4(-1.27,0) 5(1.27,0) 6(3.81,0) 7(6.35,0) 8(8.89,0)
HDR-TH_15P-P2.54-V-F-1
  rect 1.6x1.575 hole 1: 1(-17.78,0)
  round 1.6 hole 1: 2(-15.24,0) 3(-12.7,0) 4(-10.16,0) 5(-7.62,0) 6(-5.08,0) 7(-2.54,0) 8(0,0) 9(2.54,0) 10(5.08,0) 11(7.62,0) 12(10.16,0) 13(12.7,0) 14(15.24,0) 15(17.78,0)
IND-SMD_L2.0-W1.3
  rect 1x1.25 smd: 1(-1,0) 2(1,0)
Pad_e23642
  round 1.3 hole 1.152: 1(0,0)
Pad_e23772
  round 1.3 hole 1.152: 1(0,0)
Pad_e23773
  round 1.3 hole 1.152: 1(0,0)
Pad_e100399
  round 3.3 hole 3.3: 1(0,0)
Pad_e100495
  round 3.3 hole 3.3: 1(0,0)
Pad_e100800
  round 3.3 hole 3.3: 1(0,0)
R0603
  rect 0.806x0.864 smd: 1(-0.753,0) 2(0.753,0)
R0805
  rect 1.133x1.377 smd: 1(-1,0) 2(1,0)
SMA_L4.4-W2.8-LS5.4-R-RD
  rect 2.062x1.539 smd: 1(2.503,0) 2(-2.503,0)
SOIC-8_L5.0-W4.0-P1.27-LS6.0-BL
  oval 0.569x1.95 smd: 1(-1.905,-2.705) 2(-0.635,-2.705) 3(0.635,-2.705) 4(1.905,-2.705) 5(1.905,2.705) 6(0.635,2.705) 7(-0.635,2.705) 8(-1.905,2.705)
SOP-8_L4.9-W3.9-P1.27-LS6.0-BL
  oval 0.63x1.865 smd: 1(-1.905,-2.683) 2(-0.635,-2.683) 3(0.635,-2.683) 4(1.905,-2.683) 5(1.905,2.683) 6(0.635,2.683) 7(-0.635,2.683) 8(-1.905,2.683)
USB-C-SMD_TYPE-C-6PIN-2MD-073
  rect 0.55x1.1 smd: 1(-3.2,2.375) 2(-2.4,2.375) 11(2.4,2.375) 12(3.2,2.375)
  rect 0.3x1.1 smd: 3(-1.75,2.375) 4(-1.25,2.375) 5(-0.75,2.375) 6(-0.25,2.375) 7(0.25,2.375) 8(0.75,2.375) 9(1.25,2.375) 10(1.75,2.375)
  oval 1.1x2 hole 0.6x1.5: 13(-4.325,1.825) 14(4.325,1.825)
  oval 1.2x1.8 hole 0.6x1.2: 13(-4.325,-2.375) 14(4.325,-2.375)

## Nets
As in the schematic.

Pads without a net: ALT_MOT 1; AZ_MOT 1; CH340N 4; NOREF 1; NOREF#2 1; NOREF#3 1; NOREF#4 1; NOREF#5 1; NOREF#6 1; U2 3; USB1 3 4 9 10

## Via types
v1: diameter 0.61, hole 0.305, Top Layer to Bottom Layer, 100 vias
v2: diameter 1.5, hole 0.7, Top Layer to Bottom Layer, 17 vias

## Routing (per net, layer and track width the routed paths; a pad name or vN(x,y) marks a point on that pad's centre or on a via; arc(x,y) is an arc through that point)
5V2A: length 164.8
  Top Layer w0.508: POWER_SELECTOR.2 20.83,40.77 21.59,40 25.22,40 ESP_RIGHT.15 ; 32.76,58.67 32.51,58.92 32.51,70.23 31.12,70.23
  Top Layer w0.762: 27.31,72.77 27.43,72.9 33.85,72.9 33.85,54.17 29.97,50.29 29.97,49.91 ; 29.97,49.91 42.8,49.91 ; 29.97,49.91 29.97,48.89 27.56,46.48 23.37,46.48 ; POWER_SELECTOR.1 23.37,46.48 ; 23.37,46.48 20.07,46.48 20.07,51.19 POWERPINS.1
  Bottom Layer w0.508: SENSOR1.1 35.51,6.24 31.18,6.24 29.96,5.02 I2C.1
  Bottom Layer w0.762: SENSOR1.1 37.13,5.08 v2(42.86,10.81) ; v2(42.86,10.81) 42.8,10.87 42.8,49.91 ; v2(42.86,10.81) 47.33,6.34 SENSOR2.1
  vias: v2(42.78,49.8)
GND: length 2.3
  Top Layer w0.508: 7,46.6 7.27,46.88 7.27,47.63 ; 7.04,55.23 7.04,54.59 7.39,54.24
  vias: v1(1.52,44.36) v1(3.68,29.97) v1(4.37,44.07) v1(4.44,39.89) v1(5.08,25.15) v1(5.08,22.35) v1(5.08,18.54) v1(5.21,29.97) v1(5.33,10.03) v1(6.48,44.07) v1(6.73,16.13) v1(7.17,29.97) v1(9.91,35.05) v1(9.91,30.48) v1(10.03,48.26) v1(10.03,44.83) v1(10.16,18.16) v1(10.16,13.58) v1(10.41,25.91) v1(11.63,40.97) v1(11.63,40.08) v1(12.45,36.8) v1(12.46,33.07) v1(12.57,2.41) v1(13.21,29.21) v1(15.75,73.91) v1(15.75,66.17) v1(15.86,50.01) v1(16.62,50.01) v1(16.76,54.48) v1(16.89,57.65) v1(17.38,50.01) v1(17.53,54.48) v1(18.32,54.49) v1(18.92,66.17) v1(21.84,58.17) v1(21.84,57.4) v1(21.97,70.23) v1(22.22,62.61) v1(22.22,61.72) v1(22.22,60.83) v1(22.22,59.94) v1(22.71,58.17) v1(22.72,57.4) v1(23.24,62.61) v1(23.24,61.72) v1(23.24,60.83) v1(23.24,59.94) v1(23.62,58.17) v1(23.62,57.4) v1(26.16,44.32) v1(26.99,44.32) v1(27.84,44.32) v1(29.21,39.75) v1(29.21,38.82) v1(30.98,55.89) v1(30.99,54.86) v1(31.19,7.37) v1(32.13,7.37) v1(35.18,55.88) v1(35.18,54.5) v1(41.66,48.6) v1(41.66,47.32) v1(41.66,46.23) v1(44.46,54.61) v1(45.47,54.61) v1(53.72,6.99) v1(53.97,29.08) v1(54.23,12.83) v1(54.74,44.32) v1(54.86,27.94) v1(55.37,60.83) v1(55.8,29.07) v1(55.8,12.8) v1(55.8,11.43) v1(56.13,44.32) v1(56.13,43.18) v1(56.39,59.56) v1(57.17,60.83) v1(57.59,6.99) v1(69.37,4.95) v1(71.5,4.95) v1(72.38,64.21) v1(72.38,62.37) v1(72.44,48.16) v1(72.44,46.13) v1(72.44,32.14) v1(72.44,30.14) v1(72.38,17.05) v1(72.43,15.23) v2(19.3,8.76) v2(26.54,54.92) v2(30.35,16.76) v2(37.21,10.54) v2(40.51,18.16) v2(40.89,36.19) v2(40.89,28.83) v2(49.91,38.35) v2(49.85,16.7) v2(50.16,28.83)
ALT_A1: length 17.6
  Top Layer w0.508: ALT_RIGHT.4 60.52,63.25 64.38,59.4 ALT_MOT.4
ALT_A2: length 22.2
  Bottom Layer w0.508: ALT_MOT.2 66.14,54.4 ALT_RIGHT.3
ALT_B1: length 16.1
  Bottom Layer w0.508: ALT_MOT.3 68.72,56.9 ALT_RIGHT.5
ALT_B2: length 12.2
  Bottom Layer w0.508: ALT_RIGHT.6 66.26,61.9 67.2,60.96 74.86,60.96 ALT_MOT.5
ALT_DIR: length 96.6
  Top Layer w0.254: ESP_LEFT.1 0.73,7.49 0.73,9.09 1.75,10.11 3.19,10.11 8.52,15.44 8.52,26.87 14.62,32.97 27.57,32.97 29.86,35.26 37.73,35.26 51.19,48.72 67.96,48.72 ALT_LEFT.8
ALT_EN: length 58.1
  Top Layer w0.254: ALT_LEFT.1 37.22,35.76 29.6,35.76 29.35,35.51 12.33,35.51 v1(8.52,31.7)
  Bottom Layer w0.254: ESP_LEFT.11 2.08,31.7 v1(8.52,31.7)
ALT_STEP: length 47.3
  Top Layer w0.254: ALT_LEFT.7 66.18,52.02 51.19,52.02 35.87,36.7 ESP_RIGHT.13
AZ_A1: length 17.6
  Bottom Layer w0.508: AZ_MOT.4 63.69,11.39 AZ_RIGHT.4
AZ_A2: length 22.2
  Bottom Layer w0.508: AZ_MOT.2 66.15,6.39 AZ_RIGHT.3
AZ_B1: length 16.1
  Top Layer w0.508: AZ_RIGHT.5 68.73,8.89 AZ_MOT.3
AZ_B2: length 12
  Bottom Layer w0.508: AZ_MOT.5 75.12,13.21 66.95,13.21 66.27,13.89 AZ_RIGHT.6
AZ_DIR: length 78
  Bottom Layer w0.254: ESP_LEFT.6 11.4,9.52 11.4,8.25 13.43,6.22 17.24,6.22 18.26,5.2 18.26,4.44 21.22,1.48 48.65,1.48 51.19,4.02 68.72,4.02 AZ_LEFT.8
AZ_EN: length 32.1
  Top Layer w0.254: AZ_LEFT.1 52.21,3 36.29,18.92 ESP_RIGHT.6
AZ_STEP: length 79.7
  Bottom Layer w0.254: ESP_LEFT.7 0.73,20.19 0.73,15.87 1.49,15.11 2.51,15.11 16.65,0.97 65.67,0.97 AZ_LEFT.7
DEC_A1: length 21.3
  Bottom Layer w0.508: DEC_MOT.2 64.27,23.52 59.8,27.99 DEC_RIGHT.4
DEC_A2: length 25.5
  Bottom Layer w0.508: DEC_MOT.1 63.18,21.02 57.26,26.94 DEC_RIGHT.3
DEC_B1: length 17.1
  Bottom Layer w0.508: DEC_RIGHT.5 62.34,29.04 65.37,26.02 DEC_MOT.3
DEC_B2: length 12.9
  Bottom Layer w0.508: DEC_RIGHT.6 64.88,30.1 66.46,28.52 DEC_MOT.4
DEC_DIR: length 75.9
  Top Layer w0.254: v1(11.4,18.92) 12.75,20.27 48.4,20.27 51.19,17.48 53.22,17.48 53.48,17.73 53.48,19.26 54.24,20.02 57.8,20.02 58.56,19.26 58.56,18.24 59.32,17.48 68.72,17.48 DEC_LEFT.8
  Bottom Layer w0.254: v1(11.4,18.92) 6.32,24 ESP_LEFT.8
DEC_EN: length 26.3
  Top Layer w0.254: ESP_RIGHT.7 49.5,21.46 DEC_LEFT.1
DEC_STEP: length 42.6
  Top Layer w0.254: ESP_RIGHT.8 28.39,22.61 v1(58.35,22.61)
  Bottom Layer w0.254: DEC_LEFT.7 65.92,20.27 60.68,20.27 v1(58.35,22.61)
DEC_UART1: length 83.5
  Top Layer w0.254: 60.59,34.75 61.1,34.24 61.1,20.02 DEC_LEFT.4 DEC_LEFT.5 ; 60.59,34.75 RA_LEFT.5 ; 60.59,34.75 RA_LEFT.4 58.47,33.39 33.02,33.39 27.43,27.8 10.92,27.8 v1(10.67,28.06) ; v1(5.84,28.57) 5.33,28.06 R1.1 3.02,28.06 ESP_LEFT.10
  Bottom Layer w0.254: v1(5.84,28.57) 10.16,28.57 v1(10.67,28.06)
ESPRX: length 22
  Top Layer w0.254: R3.1 6.48,17.26 3.05,13.84 ESP_LEFT.4
ESPTX: length 25.5
  Top Layer w0.254: R2.1 7.87,15.54 3.63,11.3 ESP_LEFT.3
ESPVOUT: length 192.8
  Top Layer w0.254: 68.72,51.26 69.48,52.02 70.5,52.02 71.26,51.26 71.26,37.8 68.72,35.26 68.72,32.55 DEC_RIGHT.7 71.23,27.44 71.23,18.04 69.7,16.52 68.72,16.52 AZ_RIGHT.7 66.18,16.52 61.86,16.52 61.1,15.76 ; 68.72,51.26 66.89,53.09 ; 68.72,51.26 68.72,50.24 67.96,49.48 63.64,49.48 ALT_LEFT.5 ; ALT_RIGHT.7 66.18,64.52 59.32,64.52 58.56,63.76 58.56,61.42 66.89,53.09 ; 61.1,15.76 61.1,6.56 AZ_LEFT.6 AZ_LEFT.5 ; 61.1,15.76 60.08,16.77 56.72,16.77 DEC_LEFT.2 ; 66.89,53.09 51.21,53.09 36.1,37.97 12.83,37.97 11.56,39.24 9.53,39.24 8.89,38.61 v1(6.73,38.61)
  Bottom Layer w0.254: ALT_LEFT.5 ALT_LEFT.6 64.91,49.79 RA_RIGHT.7 ; v1(6.73,38.61) 6.73,41.02 5.97,41.78 ESP_LEFT.15
GPIO2: length 24.5
  Bottom Layer w0.254: 10.1,53.51 11.14,52.47 11.14,41.78 3.52,34.16 ESP_LEFT.12
GPIO12: length 30.3
  Bottom Layer w0.254: 10.1,56.05 11.16,54.99 13.59,54.99 24.97,43.61 24.97,36.19 ESP_RIGHT.12
GPIO14: length 42.9
  Top Layer w0.254: RA_LEFT.7 66.01,36.19 51.38,36.19 49.86,34.67 30.05,34.67 ESP_RIGHT.11
GPIO15: length 27.6
  Top Layer w0.254: 10.1,58.59 8.65,58.59 1.49,51.43 1.49,46.1 3.27,44.32 3.27,37.97 ESP_LEFT.13
GPIO17: length 2.3
  Top Layer w0.254: ESP_LEFT.9 2.01,26.55 R1.2
GPIO21: length 17.1
  Bottom Layer w0.254: 14.38,5.02 13.36,5.02 ESP_LEFT.5
GPIO22: length 16.4
  Top Layer w0.254: I2C.3 13.14,8.76 ESP_LEFT.2
GPIO26: length 46.4
  Top Layer w0.254: ESP_RIGHT.9 33.35,32.89 59.51,32.89 v1(59.77,33.14)
  Bottom Layer w0.254: RA_LEFT.8 68.38,33.14 v1(59.77,33.14)
GPIO27: length 27.6
  Top Layer w0.254: ESP_RIGHT.10 32.08,34.16 51.62,34.16 RA_LEFT.1
GPIO34: length 16.1
  Top Layer w0.254: ESP_RIGHT.4 35.38,5.46 35.38,4.7 37.28,2.79 HEADER4P_SENSORS.4
GPIO35: length 19.4
  Top Layer w0.254: ESP_RIGHT.5 37.92,5.46 37.92,4.65 v1(37.16,3.89)
  Bottom Layer w0.254: v1(37.16,3.89) 36.65,3.89 HEADER4P_SENSORS.3
GPIO36: length 26.1
  Top Layer w0.254: SENSOR2.2 41.28,1.52 34.29,1.52 HEADER4P_SENSORS.2 31.75,1.52 29.54,1.52 29.29,1.78 29.29,6.47 ESP_RIGHT.2
GPIO39: length 14.3
  Top Layer w0.254: SENSOR1.2 33.09,4.01 32,4.01 31.75,3.76 30.73,3.76 30.48,4.01 ; 30.48,4.01 HEADER4P_SENSORS.1 ; 30.48,4.01 30.48,7.82 ESP_RIGHT.3
PSU12V: length 72.2
  Top Layer w1: DEC_RIGHT.1 52.18,25.82 52.17,25.82 ; Cin2.2 14.99,62.63 14.99,59.06 14.73,58.81 ; 52.03,9.91 52.21,9.91 52.21,11.3 ; ALT_RIGHT.1 52.21,57.95 46.86,57.95 v2(46.86,52.32) ; 52.21,11.3 52.2,11.3 v2(46.99,11.3) ; 52.21,11.3 AZ_RIGHT.1 ; U1.2 v2(22.73,52.3) 22.73,52.83 14.99,52.83 14.99,58.56 14.73,58.81 ; 14.73,58.81 POWERPINS.4 ; RA_RIGHT.1 52.21,41.95 46.99,41.95 ; 46.99,25.78 51.83,25.78
  vias: v2(47.01,41.9) v2(47.01,25.74)
RA_A1: length 21.3
  Bottom Layer w0.508: RA_RIGHT.4 59.83,43.99 64.3,39.52 RA_MOT.2
RA_A2: length 25
  Bottom Layer w0.508: RA_MOT.1 63.95,37.02 57.29,43.68 RA_RIGHT.3
RA_B1: length 17.1
  Bottom Layer w0.508: RA_MOT.3 65.4,42.02 62.37,45.04 RA_RIGHT.5
RA_B2: length 12.9
  Bottom Layer w0.508: RA_MOT.4 66.49,44.52 64.91,46.1 RA_RIGHT.6
USB5V: length 31.8
  Top Layer w0.254: 9.87,41.98 9.87,43 8.85,44.02 8.85,47.74 8.17,48.43 8.17,48.51 ; 9.87,41.98 18.21,41.98 POWER_SELECTOR.3 ; 9.87,41.98 9.87,41.48 7.84,39.44 6.3,39.44 5.21,38.35 CH340N.5 5.06,36.67 C5.2 ; 8.17,48.51 8.17,48.59 9.11,49.53 9.11,51.89 8.6,52.4 8.6,52.91 8.18,53.33 USB1.2 ; 8.17,48.51 8.15,48.53 7.58,48.53 USB1.11
USBDN: length 18.2
  Top Layer w0.254: USB1.7 7.58,50.7 8.46,50.7 8.46,51.65 4.7,51.65 4.7,51.58 4.67,51.58 4.67,45.19 7.75,45.19 CH340N.2
USBDP: length 16.8
  Top Layer w0.254: 7.56,51.15 6.7,51.15 6.7,51.11 ; 6.7,51.11 6.7,50.2 7.58,50.2 USB1.8 ; 6.7,51.11 5.08,51.11 5.08,45.59 8.25,45.59 8.25,43.83 9.02,43.07 CH340N.1
$1N15: length 1.2
  Top Layer w0.254: C6.1 9.38,37.17 9.27,37.07
$1N26: length 2
  Top Layer w0.508: CH340N.7 7.75,35.04 R2.2
$1N27: length 1.9
  Top Layer w0.508: CH340N.6 R3.2
$1N12989: length 4.8
  Top Layer w0.254: 27.56,60.13 Ccomp2.2 27.24,60.71 ; 27.56,58.56 R4.2
  Top Layer w0.508: 27.79,60.71 U2.6 ; 27.56,60.13 27.56,58.42
$1N13151: length 1.9
  Top Layer w0.254: 29.59,58.56 R4.1
  Top Layer w0.508: Ccomp.2 29.59,58.55 R4.1
$1N13245: length 7.5
  Top Layer w0.508: Cboot.1 v1(24.76,65.15) ; U2.1 20.32,63.25 v1(20.32,65.15)
  Bottom Layer w0.508: v1(24.76,65.15) v1(20.32,65.15)
$1N13607: length 11.6
  Top Layer w0.254: 31.25,60.33 R6.2 ; 31.24,58.38 31.25,58.39
  Top Layer w0.508: U2.5 25.44,57.02 31.24,57.02 31.24,58.67 31.25,58.67 31.25,60.33 R6.2
$1N13891: length 2.2
  Top Layer w0.254: 18.35,59.44 Css.1
  Top Layer w0.508: U2.4 18.09,59.44 18.09,59.24

## Copper pours and planes (outline as drawn; the poured copper is in the pictures)
5V2A on Top Layer: 26.54,74.55 32,74.55 32,69.47 26.54,69.47
GND on Top Layer: 24.13,65.91 24.13,74.55 14.99,74.55 14.99,64.14 19.43,64.14 19.43,65.91
GND on Top Layer: 21.34,66.34 24.11,66.34 24.11,56.39 32.26,56.39 32.26,53.87 15.66,53.87 15.66,58.29 21.34,58.29
GND on Top Layer: 24,62.48 31.88,62.48 31.88,61.34 24,61.34
GND on Top Layer: 5.95,44.83 6.98,44.83 6.98,41.91 5.95,41.91
GND on Top Layer: -2.27,77.79 -2.27,-2.3 -2.39,-2.43 83.42,-2.43 84.56,-1.29 84.56,76.9 35.77,76.9 35.7,76.84 35.7,56.53 35.52,56.34 15.93,56.34 15.48,56.8 15.5,78
GND on Top Layer: 0.31,58.6 10.91,58.6 10.91,34.77 0.31,34.77
GND on Bottom Layer: -1.52,76.96 81.28,76.96 81.28,-1.14 -1.52,-1.14
PSU12V on Top Layer: 14.35,61.34 14.35,63.25 18.61,63.25 18.61,62.57 20.52,62.57 20.52,61.34
PSU12V on Top Layer: 20.7,53.51 24.51,53.51 24.51,47.37 20.7,47.37
PSU12V on Bottom Layer: 20.95,53.44 24.51,53.44 24.51,47.32 20.95,47.32
PSU12V on Bottom Layer: 20.94,53.47 48.13,53.47 48.13,51.44 20.94,51.44
PSU12V on Bottom Layer: 44.47,53.45 48.13,53.45 48.13,10.23 44.47,10.23
$1N13249 on Top Layer: 24.93,62.92 31.88,62.92 31.88,68.45 26.54,68.45 26.54,64.01 24.93,64.01

## Text on the board
Top Silkscreen Layer: + | - | Input only! | Pot this way | ESP POWER | POWERPINS | SENSOR2 | VIN | GPIO | @2025 | USB | EN | DIR | D23 | 3V3 | 12V | GND | 39 | 5V | 36 | ESP USB PLUG | 35 | 34 | 15 | 12 | 2 | DEC | ALT | RA | AZ | SDA | SCL | TMC2209 | A4988 | OpenAstroExplorer | v1.0 | OpenAstroTech
